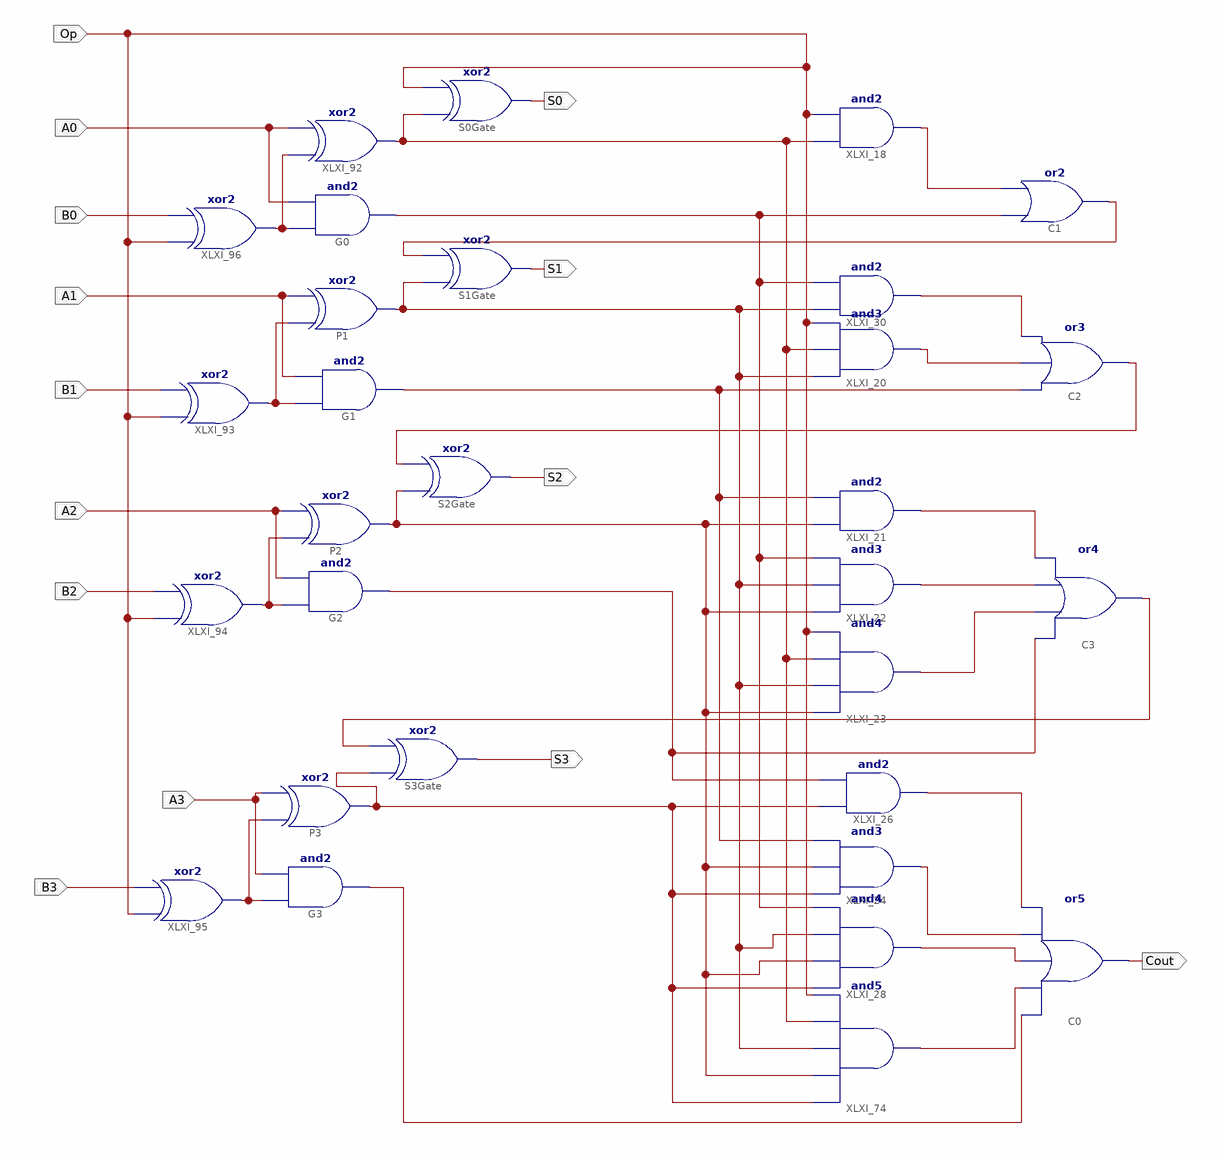
[diagram p0: schematic sheet 1]
// Xilinx ISE schematic Lab5LookAheadAdder.sch (spartan3e) as structural Verilog: 30 symbols, 14 ports
module Lab5LookAheadAdder (
  input  A3,
  input  A1,
  input  Op,
  input  A0,
  input  B0,
  input  B1,
  input  B2,
  input  B3,
  input  A2,
  output S0,
  output S2,
  output S1,
  output S3,
  output Cout
);

  wire XLXN_102, XLXN_104, XLXN_105, XLXN_134, XLXN_135, XLXN_136, XLXN_141, XLXN_142, XLXN_143, XLXN_144,
       XLXN_145, XLXN_146, XLXN_150, XLXN_160, XLXN_161, XLXN_162, XLXN_163, XLXN_164, XLXN_165, XLXN_168,
       XLXN_183, XLXN_247, XLXN_248, XLXN_249, XLXN_259;

  xor P2 (XLXN_143, XLXN_248, A2);
  and G2 (XLXN_150, XLXN_248, A2);
  and G3 (XLXN_183, XLXN_249, A3);
  and XLXI_18 (XLXN_102, XLXN_141, Op);
  or C1 (XLXN_136, XLXN_145, XLXN_102);
  and XLXI_20 (XLXN_105, XLXN_142, XLXN_141, Op);
  and XLXI_21 (XLXN_162, XLXN_143, XLXN_146);
  and XLXI_22 (XLXN_161, XLXN_143, XLXN_142, XLXN_145);
  and XLXI_23 (XLXN_160, XLXN_143, XLXN_142, XLXN_141, Op);
  and XLXI_24 (XLXN_164, XLXN_144, XLXN_143, XLXN_146);
  or C2 (XLXN_135, XLXN_146, XLXN_105, XLXN_104);
  or C3 (XLXN_134, XLXN_150, XLXN_160, XLXN_161, XLXN_162);
  or C0 (Cout, XLXN_183, XLXN_168, XLXN_165, XLXN_164, XLXN_163);
  and XLXI_28 (XLXN_165, XLXN_144, XLXN_143, XLXN_142, XLXN_145);
  and XLXI_74 (XLXN_168, XLXN_144, XLXN_143, XLXN_142, XLXN_141, Op);
  and XLXI_30 (XLXN_104, XLXN_142, XLXN_145);
  xor S0Gate (S0, XLXN_141, Op);
  xor S2Gate (S2, XLXN_143, XLXN_135);
  xor S1Gate (S1, XLXN_142, XLXN_136);
  xor S3Gate (S3, XLXN_144, XLXN_134);
  xor P3 (XLXN_144, XLXN_249, A3);
  and XLXI_26 (XLXN_163, XLXN_144, XLXN_150);
  and G0 (XLXN_145, XLXN_259, A0);
  xor XLXI_92 (XLXN_141, XLXN_259, A0);
  xor XLXI_96 (XLXN_259, Op, B0);
  and G1 (XLXN_146, XLXN_247, A1);
  xor P1 (XLXN_142, XLXN_247, A1);
  xor XLXI_93 (XLXN_247, Op, B1);
  xor XLXI_94 (XLXN_248, Op, B2);
  xor XLXI_95 (XLXN_249, Op, B3);
endmodule
